# Altium project EMG_v5.PrjPcb
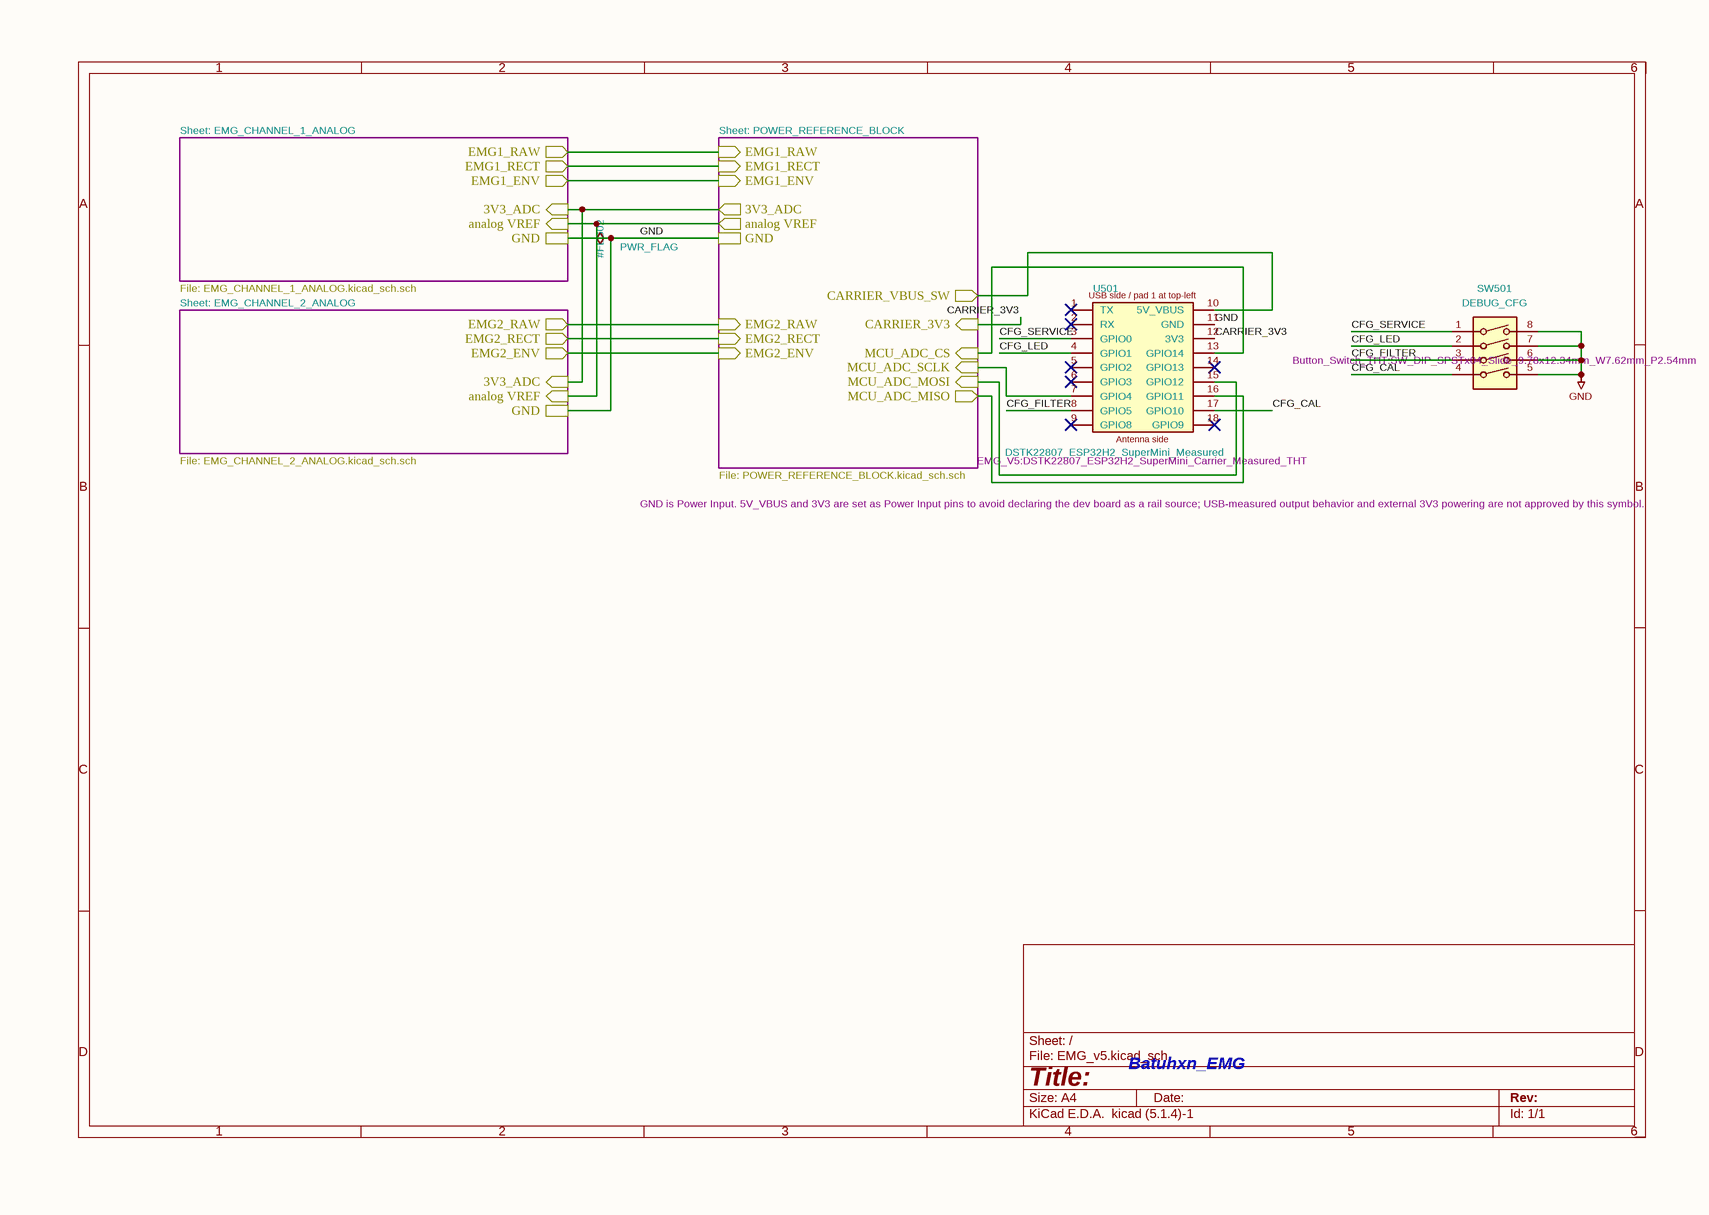
[diagram p0: EMG_v5.SchDoc]
4 sheets, 139 parts. Net scope: hierarchical (ports join the sheet entries above them; power ports are global).
Board file: EMG_v5_FAB_READY.PcbDoc
Sheets:
  EMG_v5.SchDoc
    POWER_REFERENCE_BLOCK = POWER_REFERENCE_BLOCK.SchDoc
    EMG_CHANNEL_1_ANALOG = EMG_CHANNEL_1_ANALOG.SchDoc
    EMG_CHANNEL_2_ANALOG = EMG_CHANNEL_2_ANALOG.SchDoc

## Sheet EMG_v5.SchDoc
size 297 x 209 mm

### Parts
#FLG02  PWR_FLAG  (graphical)
SW501  Footprint: Button_Switch_THT:SW_DIP_SPSTx04_Slide_9.78x12.34mm_W7.62mm_P2.54mm  [SW_DIP_SPSTx04_Slide_9.78x12.34mm_W7.62mm_P2.54mm]  (hidden comment: DEBUG_CFG)
U501  Power_Assumption: GND is Power Input. 5V_VBUS and 3V3 are set as Power Input pins to avoid declaring the dev board as a rail source; USB-measured output behavior and external 3V3 powering are not approved by this symbol.  Footprint: EMG_V5:DSTK22807_ESP32H2_SuperMini_Carrier_Measured_THT  [DSTK22807_ESP32H2_SuperMini_Carrier_Measured_THT]  (hidden comment: DSTK22807_ESP32H2_SuperMini_Measured)

### Sub-sheets
EMG_CHANNEL_1_ANALOG = EMG_CHANNEL_1_ANALOG.SchDoc: EMG1_RAW (out), EMG1_RECT (out), EMG1_ENV (out), 3V3_ADC (in), analog VREF (in), GND
EMG_CHANNEL_2_ANALOG = EMG_CHANNEL_2_ANALOG.SchDoc: EMG2_RAW (out), EMG2_RECT (out), EMG2_ENV (out), 3V3_ADC (in), analog VREF (in), GND
POWER_REFERENCE_BLOCK = POWER_REFERENCE_BLOCK.SchDoc: EMG1_RAW (in), EMG1_RECT (in), EMG1_ENV (in), EMG2_RAW (in), EMG2_RECT (in), EMG2_ENV (in), 3V3_ADC (out), analog VREF (out), GND, CARRIER_VBUS_SW (out), CARRIER_3V3 (in), MCU_ADC_MISO (out), MCU_ADC_MOSI (in), MCU_ADC_SCLK (in), MCU_ADC_CS (in)

### Nets
GND: #FLG02.1 SW501.5 SW501.6 SW501.7 SW501.8 U501.11(GND) ; sheet POWER_REFERENCE_BLOCK/GND, sheet EMG_CHANNEL_1_ANALOG/GND, sheet EMG_CHANNEL_2_ANALOG/GND
3V3_ADC: sheet POWER_REFERENCE_BLOCK/3V3_ADC, sheet EMG_CHANNEL_1_ANALOG/3V3_ADC, sheet EMG_CHANNEL_2_ANALOG/3V3_ADC
analog VREF: sheet POWER_REFERENCE_BLOCK/analog VREF, sheet EMG_CHANNEL_1_ANALOG/analog VREF, sheet EMG_CHANNEL_2_ANALOG/analog VREF
CARRIER_3V3: U501.12(3V3) ; sheet POWER_REFERENCE_BLOCK/CARRIER_3V3
CARRIER_VBUS_SW: U501.10(5V_VBUS) ; sheet POWER_REFERENCE_BLOCK/CARRIER_VBUS_SW
CFG_CAL: SW501.4 U501.17(GPIO10)
CFG_FILTER: SW501.3 U501.8(GPIO5)
CFG_LED: SW501.2 U501.4(GPIO1)
CFG_SERVICE: SW501.1 U501.3(GPIO0)
EMG1_ENV: sheet POWER_REFERENCE_BLOCK/EMG1_ENV, sheet EMG_CHANNEL_1_ANALOG/EMG1_ENV
EMG1_RAW: sheet POWER_REFERENCE_BLOCK/EMG1_RAW, sheet EMG_CHANNEL_1_ANALOG/EMG1_RAW
EMG1_RECT: sheet POWER_REFERENCE_BLOCK/EMG1_RECT, sheet EMG_CHANNEL_1_ANALOG/EMG1_RECT
EMG2_ENV: sheet POWER_REFERENCE_BLOCK/EMG2_ENV, sheet EMG_CHANNEL_2_ANALOG/EMG2_ENV
EMG2_RAW: sheet POWER_REFERENCE_BLOCK/EMG2_RAW, sheet EMG_CHANNEL_2_ANALOG/EMG2_RAW
EMG2_RECT: sheet POWER_REFERENCE_BLOCK/EMG2_RECT, sheet EMG_CHANNEL_2_ANALOG/EMG2_RECT
MCU_ADC_CS: U501.13(GPIO14) ; sheet POWER_REFERENCE_BLOCK/MCU_ADC_CS
MCU_ADC_MISO: U501.16(GPIO11) ; sheet POWER_REFERENCE_BLOCK/MCU_ADC_MISO
MCU_ADC_MOSI: U501.15(GPIO12) ; sheet POWER_REFERENCE_BLOCK/MCU_ADC_MOSI
MCU_ADC_SCLK: U501.7(GPIO4) ; sheet POWER_REFERENCE_BLOCK/MCU_ADC_SCLK

Not connected (* = marked no-connect by the designer): U501 1(TX)* 2(RX)* 5(GPIO2)* 6(GPIO3)* 9(GPIO8)* 14(GPIO13)* 18(GPIO9)*

### Notes on the sheet
- Sheet: EMG_CHANNEL_1_ANALOG
- Sheet: POWER_REFERENCE_BLOCK
- File: EMG_CHANNEL_1_ANALOG.kicad_sch.sch
- Sheet: EMG_CHANNEL_2_ANALOG
- File: EMG_CHANNEL_2_ANALOG.kicad_sch.sch
- File: POWER_REFERENCE_BLOCK.kicad_sch.sch
- Batuhxn_EMG
- 1
- 2
- 3
- 4
- 5
- 6
- A
- B
- C
- D
- Title:
- File: EMG_v5.kicad_sch
- Sheet: /
- KiCad E.D.A.  kicad (5.1.4)-1
- Size: A4
- Date:
- Rev:
- Id: 1/1
- (in symbol DSTK22807_ESP32H2_SuperMini_Measured) USB side / pad 1 at top-left; Antenna side

### Library data of the parts
SW501 = SW_DIP_x04: Value: DEBUG_CFG
#FLG02 = PWR_FLAG: Value: PWR_FLAG
U501 = DSTK22807_ESP32H2_SuperMini_Measured: Value: DSTK22807_ESP32H2_SuperMini_Measured

## Sheet POWER_REFERENCE_BLOCK.SchDoc
size 594 x 420 mm
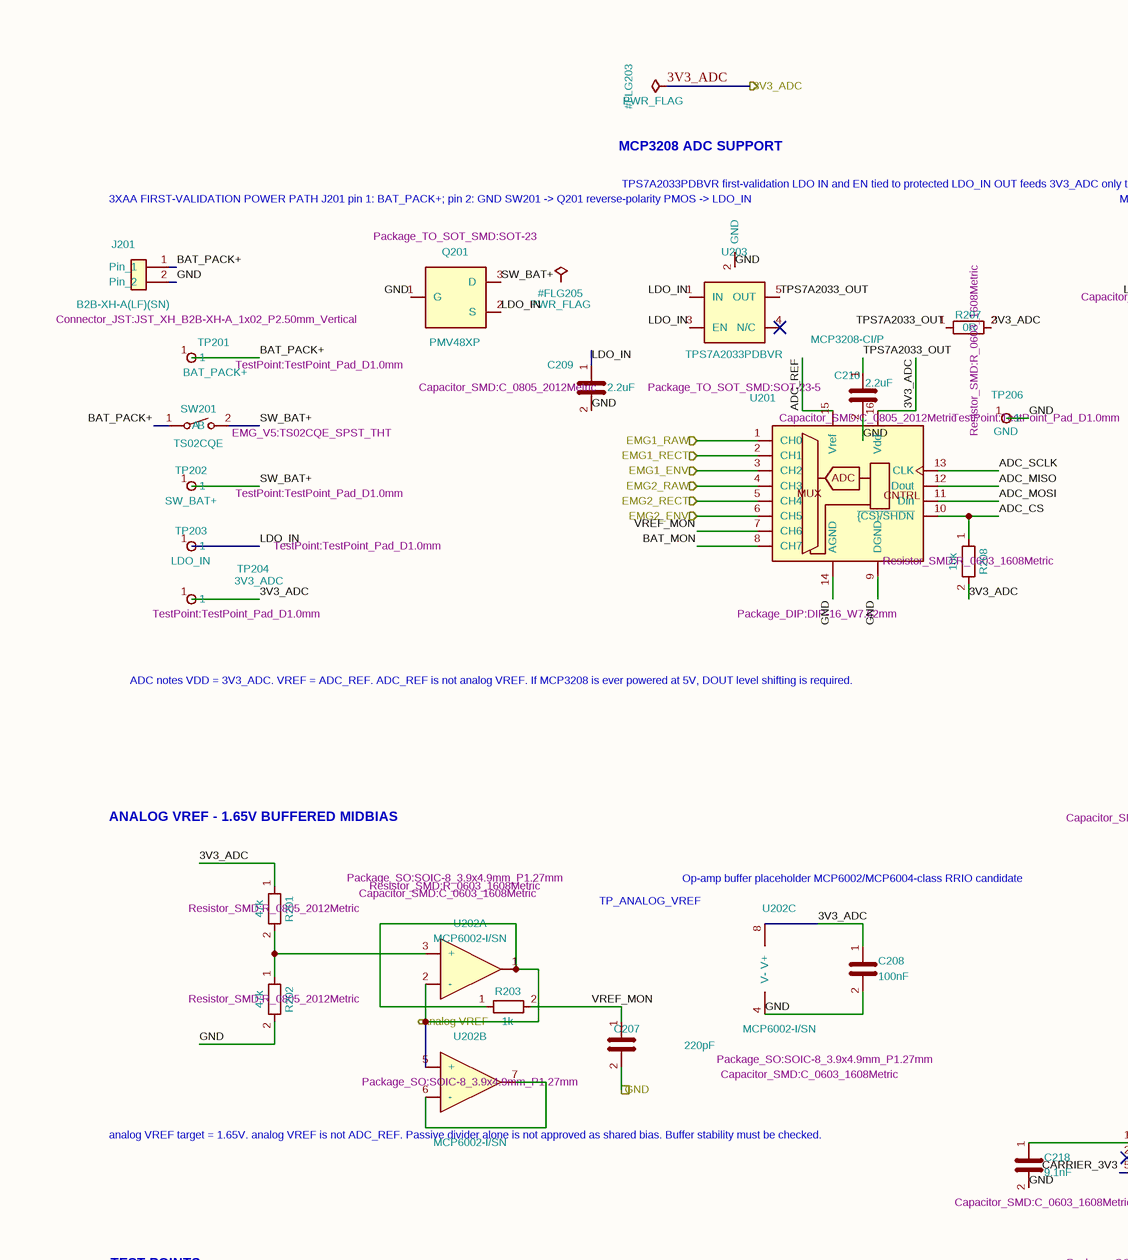
[diagram p1: POWER_REFERENCE_BLOCK.SchDoc, top left]
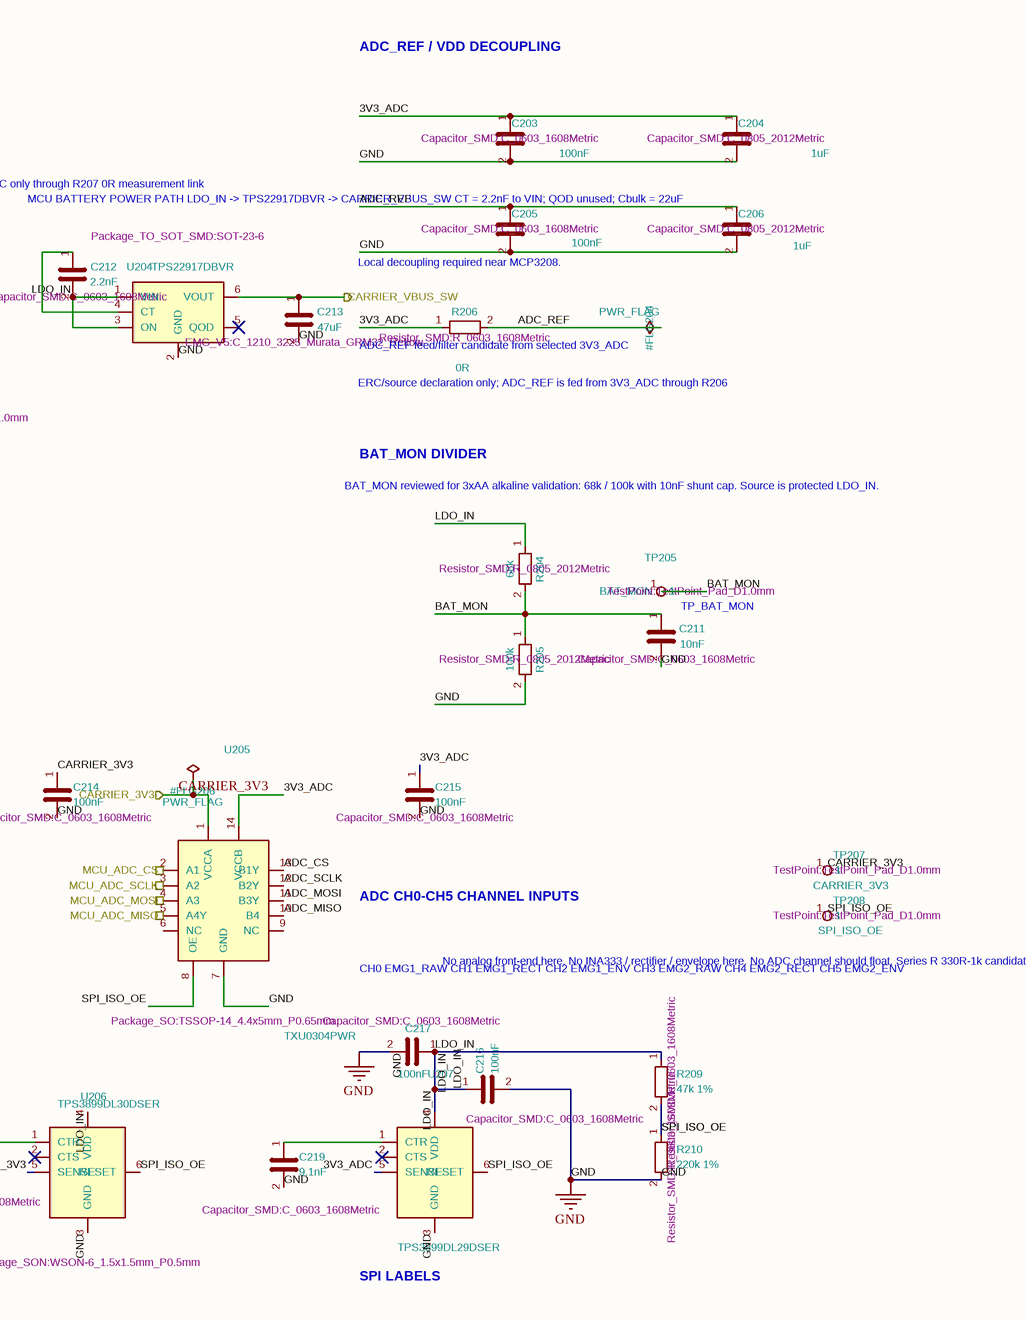
[diagram p2: POWER_REFERENCE_BLOCK.SchDoc, top right]
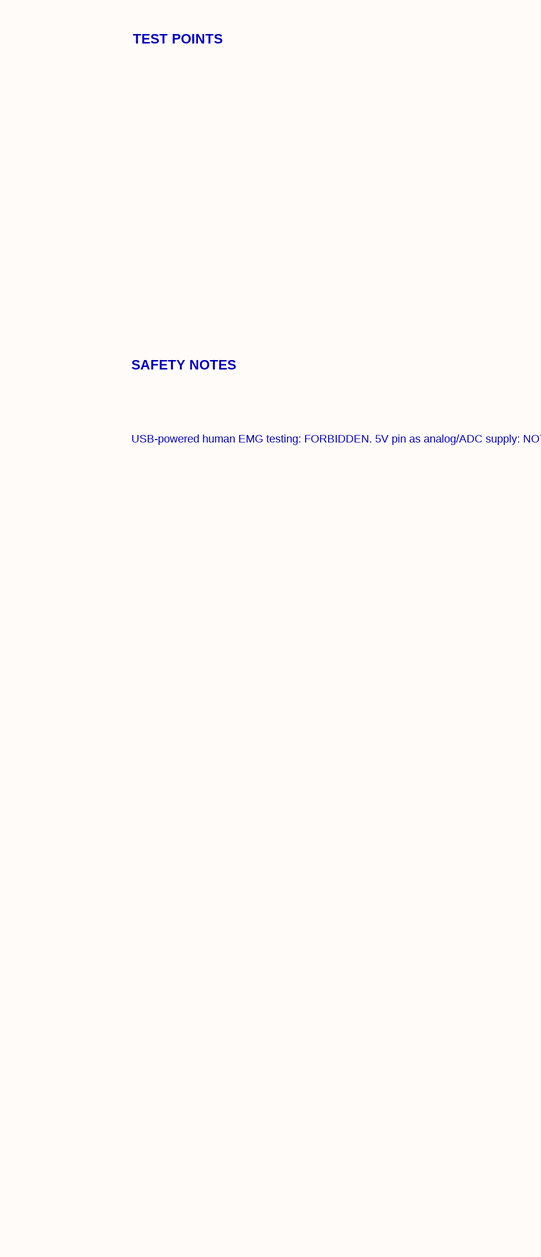
[diagram p3: POWER_REFERENCE_BLOCK.SchDoc, bottom left]
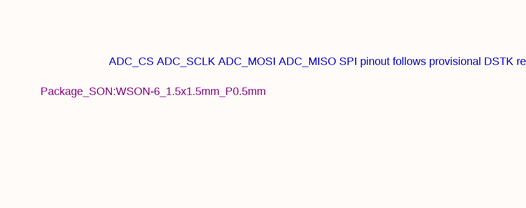
[diagram p4: POWER_REFERENCE_BLOCK.SchDoc, bottom right]

### Parts
#FLG203  PWR_FLAG  (graphical)
#FLG204  PWR_FLAG  (graphical)
#FLG205  PWR_FLAG  (graphical)
#FLG206  PWR_FLAG  (graphical)
C203  Footprint: Capacitor_SMD:C_0603_1608Metric  [C_0603_1608Metric]  (hidden comment: 100nF)
C204  Footprint: Capacitor_SMD:C_0805_2012Metric  [C_0805_2012Metric]  (hidden comment: 1uF)
C205  Footprint: Capacitor_SMD:C_0603_1608Metric  [C_0603_1608Metric]  (hidden comment: 100nF)
C206  Footprint: Capacitor_SMD:C_0805_2012Metric  [C_0805_2012Metric]  (hidden comment: 1uF)
C207  Footprint: Capacitor_SMD:C_0603_1608Metric  [C_0603_1608Metric]  (hidden comment: 220pF)
C208  Footprint: Capacitor_SMD:C_0603_1608Metric  [C_0603_1608Metric]  (hidden comment: 100nF)
C209  Footprint: Capacitor_SMD:C_0805_2012Metric  [C_0805_2012Metric]  (hidden comment: 2.2uF)
C210  Footprint: Capacitor_SMD:C_0805_2012Metric  [C_0805_2012Metric]  (hidden comment: 2.2uF)
C211  Footprint: Capacitor_SMD:C_0603_1608Metric  [C_0603_1608Metric]  (hidden comment: 10nF)
C212  Footprint: Capacitor_SMD:C_0603_1608Metric  [C_0603_1608Metric]  (hidden comment: 2.2nF)
C213  Footprint: EMG_V5:C_1210_3225_Murata_GRM32_Reflow  [C_1210_3225_Murata_GRM32_Reflow]  (hidden comment: 47uF)
C214  Footprint: Capacitor_SMD:C_0603_1608Metric  [C_0603_1608Metric]  (hidden comment: 100nF)
C215  Footprint: Capacitor_SMD:C_0603_1608Metric  [C_0603_1608Metric]  (hidden comment: 100nF)
C216  Footprint: Capacitor_SMD:C_0603_1608Metric  [C_0603_1608Metric]  (hidden comment: 100nF)
C217  Footprint: Capacitor_SMD:C_0603_1608Metric  [C_0603_1608Metric]  (hidden comment: 100nF)
C218  Footprint: Capacitor_SMD:C_0603_1608Metric  [C_0603_1608Metric]  (hidden comment: 9.1nF)
C219  Footprint: Capacitor_SMD:C_0603_1608Metric  [C_0603_1608Metric]  (hidden comment: 9.1nF)
J201  Footprint: Connector_JST:JST_XH_B2B-XH-A_1x02_P2.50mm_Vertical  [JST_XH_B2B-XH-A_1x02_P2.50mm_Vertical]  (hidden comment: B2B-XH-A(LF)(SN))
Q201  Footprint: Package_TO_SOT_SMD:SOT-23  [SOT-23]  (hidden comment: PMV48XP)
R201  Footprint: Resistor_SMD:R_0805_2012Metric  [R_0805_2012Metric]  (hidden comment: 47k)
R202  Footprint: Resistor_SMD:R_0805_2012Metric  [R_0805_2012Metric]  (hidden comment: 47k)
R203  Footprint: Resistor_SMD:R_0603_1608Metric  [R_0603_1608Metric]  (hidden comment: 1k)
R204  Footprint: Resistor_SMD:R_0805_2012Metric  [R_0805_2012Metric]  (hidden comment: 68k)
R205  Footprint: Resistor_SMD:R_0805_2012Metric  [R_0805_2012Metric]  (hidden comment: 100k)
R206  Footprint: Resistor_SMD:R_0603_1608Metric  [R_0603_1608Metric]  (hidden comment: 0R)
R207  Footprint: Resistor_SMD:R_0603_1608Metric  [R_0603_1608Metric]  (hidden comment: 0R)
R208  Footprint: Resistor_SMD:R_0603_1608Metric  [R_0603_1608Metric]  (hidden comment: 10k)
R209  Footprint: Resistor_SMD:R_0603_1608Metric  [R_0603_1608Metric]  (hidden comment: 47k 1%)
R210  Footprint: Resistor_SMD:R_0603_1608Metric  [R_0603_1608Metric]  (hidden comment: 220k 1%)
SW201  Footprint: EMG_V5:TS02CQE_SPST_THT  [TS02CQE_SPST_THT]  (hidden comment: TS02CQE)
TP201  Footprint: TestPoint:TestPoint_Pad_D1.0mm  [TestPoint_Pad_D1.0mm]  (hidden comment: BAT_PACK+)
TP202  Footprint: TestPoint:TestPoint_Pad_D1.0mm  [TestPoint_Pad_D1.0mm]  (hidden comment: SW_BAT+)
TP203  Footprint: TestPoint:TestPoint_Pad_D1.0mm  [TestPoint_Pad_D1.0mm]  (hidden comment: LDO_IN)
TP204  Footprint: TestPoint:TestPoint_Pad_D1.0mm  [TestPoint_Pad_D1.0mm]  (hidden comment: 3V3_ADC)
TP205  Footprint: TestPoint:TestPoint_Pad_D1.0mm  [TestPoint_Pad_D1.0mm]  (hidden comment: BAT_MON)
TP206  Footprint: TestPoint:TestPoint_Pad_D1.0mm  [TestPoint_Pad_D1.0mm]  (hidden comment: GND)
TP207  Footprint: TestPoint:TestPoint_Pad_D1.0mm  [TestPoint_Pad_D1.0mm]  (hidden comment: CARRIER_3V3)
TP208  Footprint: TestPoint:TestPoint_Pad_D1.0mm  [TestPoint_Pad_D1.0mm]  (hidden comment: SPI_ISO_OE)
U201  Footprint: Package_DIP:DIP-16_W7.62mm  [DIP-16_W7.62mm]  (hidden comment: MCP3208-CI/P)
U202  Footprint: Package_SO:SOIC-8_3.9x4.9mm_P1.27mm  [SOIC-8_3.9x4.9mm_P1.27mm]  (hidden comment: MCP6002-I/SN)  (parts A,B,C of 3)
U203  Footprint: Package_TO_SOT_SMD:SOT-23-5  [SOT-23-5]  (hidden comment: TPS7A2033PDBVR)
U204  Footprint: Package_TO_SOT_SMD:SOT-23-6  [SOT-23-6]  (hidden comment: TPS22917DBVR)
U205  Footprint: Package_SO:TSSOP-14_4.4x5mm_P0.65mm  [TSSOP-14_4.4x5mm_P0.65mm]  (hidden comment: TXU0304PWR)
U206  Footprint: Package_SON:WSON-6_1.5x1.5mm_P0.5mm  [WSON-6_1.5x1.5mm_P0.5mm]  (hidden comment: TPS3899DL30DSER)
U207  Footprint: Package_SON:WSON-6_1.5x1.5mm_P0.5mm  [WSON-6_1.5x1.5mm_P0.5mm]  (hidden comment: TPS3899DL29DSER)

### Ports
3V3_ADC (out), analog VREF (out), CARRIER_3V3 (in), CARRIER_VBUS_SW (out), EMG1_ENV (in), EMG1_RAW (in), EMG1_RECT (in), EMG2_ENV (in), EMG2_RAW (in), EMG2_RECT (in), GND, MCU_ADC_CS (in), MCU_ADC_MISO (out), MCU_ADC_MOSI (in), MCU_ADC_SCLK (in)

### Nets
GND: C203.2 C204.2 C205.2 C206.2 C207.2 C208.2 C209.2 C210.2 C211.2 C213.2 C214.2 C215.2 C216.2 C217.2 C218.2 C219.2 J201.2(Pin_2) Q201.1(G) R202.2 R205.2 R210.2 TP206.1 U201.9(DGND) U201.14(AGND) U202.4(V-) U203.2(GND) U204.2(GND) U205.7(GND) U206.3(GND) U207.3(GND) ; port GND
3V3_ADC: #FLG203.1 C203.1 C204.1 C208.1 C215.1 R201.1 R206.1 R207.2 R208.2 TP204.1 U201.16(Vdd) U202.8(V+) U205.14(VCCB) U207.5(SENSE) ; port 3V3_ADC
ADC_CS: R208.1 U201.10(~{{CS}/SHDN}) U205.13(B1Y)
ADC_MISO: U201.12(Dout) U205.10(B4)
ADC_MOSI: U201.11(Din) U205.11(B3Y)
ADC_REF: #FLG204.1 C205.1 C206.1 R206.2 U201.15(Vref)
ADC_SCLK: U201.13(CLK) U205.12(B2Y)
analog VREF: R203.1 U202.1 U202.2(-) U202.5(+) ; port analog VREF
BAT_MON: C211.1 R204.2 R205.1 TP205.1 U201.8(CH7)
BAT_PACK+: J201.1(Pin_1) SW201.1(A) TP201.1
CARRIER_3V3: #FLG206.1 C214.1 TP207.1 U205.1(VCCA) U206.5(SENSE) ; port CARRIER_3V3
CARRIER_VBUS_SW: C213.1 U204.6(VOUT) ; port CARRIER_VBUS_SW
EMG1_ENV: U201.3(CH2) ; port EMG1_ENV
EMG1_RAW: U201.1(CH0) ; port EMG1_RAW
EMG1_RECT: U201.2(CH1) ; port EMG1_RECT
EMG2_ENV: U201.6(CH5) ; port EMG2_ENV
EMG2_RAW: U201.4(CH3) ; port EMG2_RAW
EMG2_RECT: U201.5(CH4) ; port EMG2_RECT
LDO_IN: C209.1 C212.2 C216.1 C217.1 Q201.2(S) R204.1 R209.1 TP203.1 U203.1(IN) U203.3(EN) U204.1(VIN) U204.3(ON) U206.4(VDD) U207.4(VDD)
MCU_ADC_CS: U205.2(A1) ; port MCU_ADC_CS
MCU_ADC_MISO: U205.5(A4Y) ; port MCU_ADC_MISO
MCU_ADC_MOSI: U205.4(A3) ; port MCU_ADC_MOSI
MCU_ADC_SCLK: U205.3(A2) ; port MCU_ADC_SCLK
SPI_ISO_OE: R209.2 R210.1 TP208.1 U205.8(OE) U206.6(RESET) U207.6(RESET)
SW_BAT+: Q201.3(D) SW201.2(B) TP202.1
TPS7A2033_OUT: C210.1 R207.1 U203.5(OUT)
VREF_MON: C207.1 R203.2 U201.7(CH6)
NetC212_1: C212.1 U204.4(CT)
NetC218_1: C218.1 U206.1(CTR)
NetC219_1: C219.1 U207.1(CTR)
NetR201_2: R201.2 R202.1 U202.3(+)
NetU202_6: U202.6(-) U202.7

Not connected (* = marked no-connect by the designer): #FLG205 1; U203 4(N/C)*; U204 5(QOD)*; U205 6(NC) 9(NC); U206 2(CTS)*; U207 2(CTS)*

### Notes on the sheet
- ADC_REF / VDD DECOUPLING
- 3XAA FIRST-VALIDATION POWER PATH
  J201 pin 1: BAT_PACK+; pin 2: GND
  SW201 -> Q201 reverse-polarity PMOS -> LDO_IN
- (near #FLG203) MCP3208 ADC SUPPORT
- TPS7A2033PDBVR first-validation LDO
  IN and EN tied to protected LDO_IN
  OUT feeds 3V3_ADC only through R207 0R measurement link
- (near C205) MCU BATTERY POWER PATH
  LDO_IN -> TPS22917DBVR -> CARRIER_VBUS_SW
  CT = 2.2nF to VIN; QOD unused; Cbulk = 22uF
- (near C205) Local decoupling required near MCP3208.
- (near R206) ADC_REF feed/filter candidate from selected 3V3_ADC
- ERC/source declaration only; ADC_REF is fed from 3V3_ADC through R206
- BAT_MON reviewed for 3xAA alkaline validation: 68k / 100k with 10nF shunt cap. Source is protected LDO_IN.
- BAT_MON DIVIDER
- TP_BAT_MON
- ADC notes
  VDD = 3V3_ADC.
  VREF = ADC_REF.
  ADC_REF is not analog VREF.
  If MCP3208 is ever powered at 5V,
  DOUT level shifting is required.
- ANALOG VREF - 1.65V BUFFERED MIDBIAS
- Op-amp buffer placeholder
  MCP6002/MCP6004-class RRIO candidate
- TP_ANALOG_VREF
- ADC CH0-CH5 CHANNEL INPUTS
- (near TP208) No analog front-end here.
  No INA333 / rectifier / envelope here.
  No ADC channel should float.
  Series R 330R-1k candidate.
  C candidates: RAW/RECT 100pF-1nF, ENV 1nF-10nF.
- CH0 EMG1_RAW
  CH1 EMG1_RECT
  CH2 EMG1_ENV
  CH3 EMG2_RAW
  CH4 EMG2_RECT
  CH5 EMG2_ENV
- (near U202) analog VREF target = 1.65V.
  analog VREF is not ADC_REF.
  Passive divider alone is not approved as shared bias.
  Buffer stability must be checked.
- TEST POINTS
- (near U207) SPI LABELS
- ADC_CS
  ADC_SCLK
  ADC_MOSI
  ADC_MISO
  SPI pinout follows provisional DSTK review.
  Do not connect to DSTK in this task.
- SAFETY NOTES
- USB-powered human EMG testing: FORBIDDEN.
  5V pin as analog/ADC supply: NOT APPROVED.
  3V3 external powering of DSTK22807: NOT APPROVED YET.
  Battery-powered isolated operation required for human-contact testing.
  This is not a certified medical device.
  Do not use earth-referenced equipment while electrodes are attached to a human.
- 1
- 2
- 3
- 4
- 5
- 6
- 7
- 8
- 9
- 10
- 11
- A
- B
- C
- D
- E
- F
- G
- H
- Title:
- File: POWER_REFERENCE_BLOCK.kicad_sch
- Sheet: /
- KiCad E.D.A.  kicad (5.1.4)-1
- Size: A2
- Date:
- Rev:
- Id: 1/1
- (in symbol MCP3208) ADC; MUX; CNTRL

### Library data of the parts
C203-C219 = C
  C203 C205 C208 C214-C217: Value: 100nF
  C204 C206: Value: 1uF
  C207: Value: 220pF
  C209 C210: Value: 2.2uF
  C211: Value: 10nF
  C212: Value: 2.2nF
  C213: Value: 47uF
  C218 C219: Value: 9.1nF
J201 = EMG_Conn_01x02_Pin: Value: B2B-XH-A(LF)(SN)
R201-R210 = R
  R201 R202: Value: 47k
  R203: Value: 1k
  R204: Value: 68k
  R205: Value: 100k
  R206 R207: Value: 0R
  R208: Value: 10k
  R209: Value: 47k 1%
  R210: Value: 220k 1%
SW201 = EMG_SW_SPST: Value: TS02CQE
TP201 TP207 TP208 = EMG_TestPoint_1
  TP201: Value: BAT_PACK+
  TP207: Value: CARRIER_3V3
  TP208: Value: SPI_ISO_OE
TP202 = EMG_TestPoint_2: Value: SW_BAT+
TP203 = EMG_TestPoint_3: Value: LDO_IN
TP204 = EMG_TestPoint_4: Value: 3V3_ADC
TP205 = EMG_TestPoint_5: Value: BAT_MON
TP206 = EMG_TestPoint: Value: GND
U201 = MCP3208: Value: MCP3208-CI/P
U202 = MCP6002-xP: Value: MCP6002-I/SN
U204 = TPS22917DBV: Value: TPS22917DBVR
U205 = TXU0304PWR_1: Value: TXU0304PWR
U206 U207 = TPS3899DL_DSE_1
  U206: Value: TPS3899DL30DSER
  U207: Value: TPS3899DL29DSER
#FLG203-#FLG206 = PWR_FLAG: Value: PWR_FLAG
Q201 = PMV48XP: Value: PMV48XP
U203 = TPS7A2033PDBVR: Value: TPS7A2033PDBVR

## Sheet EMG_CHANNEL_1_ANALOG.SchDoc
size 594 x 420 mm
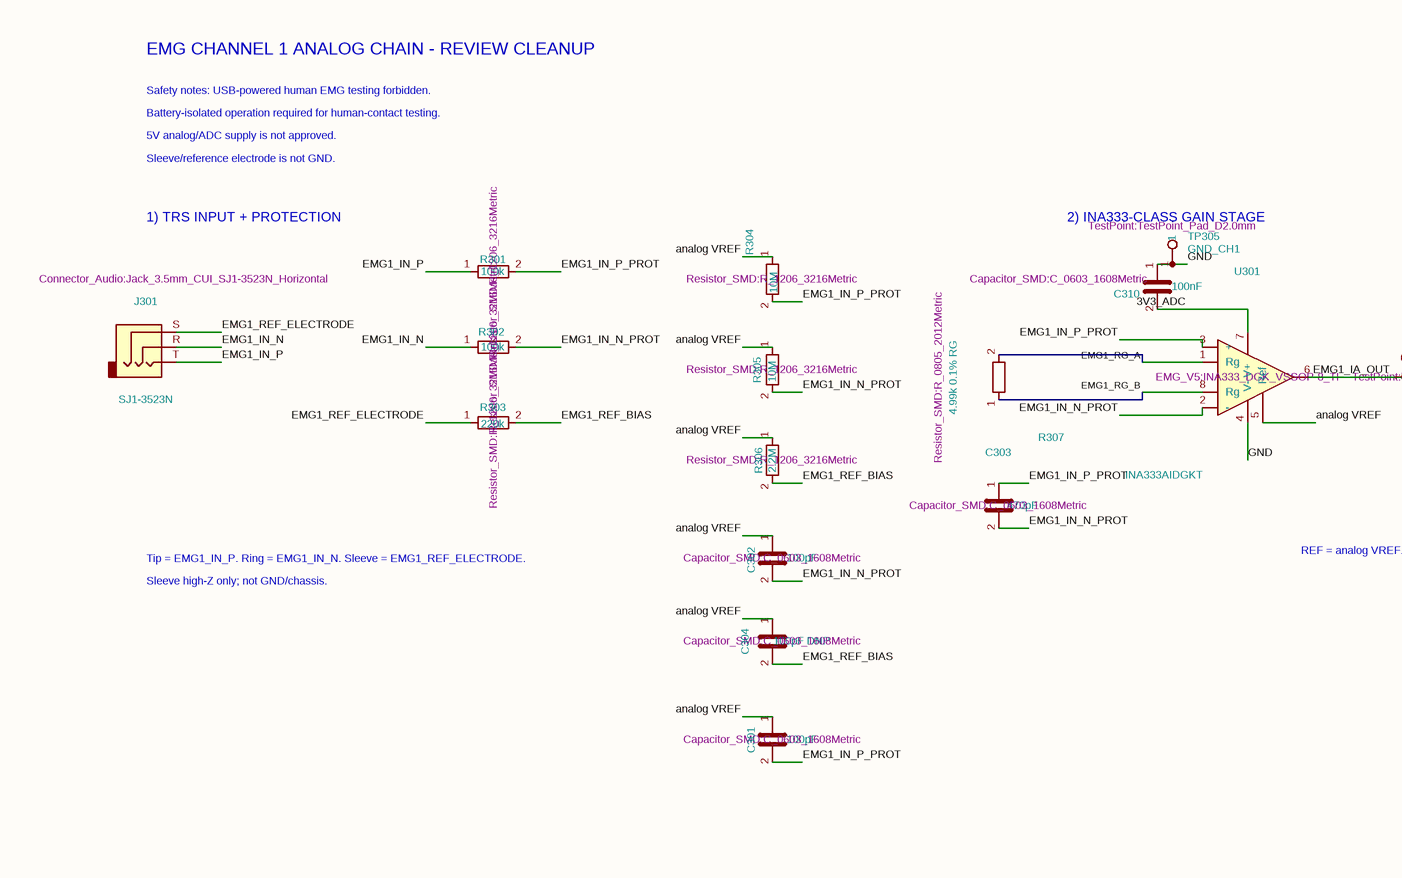
[diagram p5: EMG_CHANNEL_1_ANALOG.SchDoc, left]
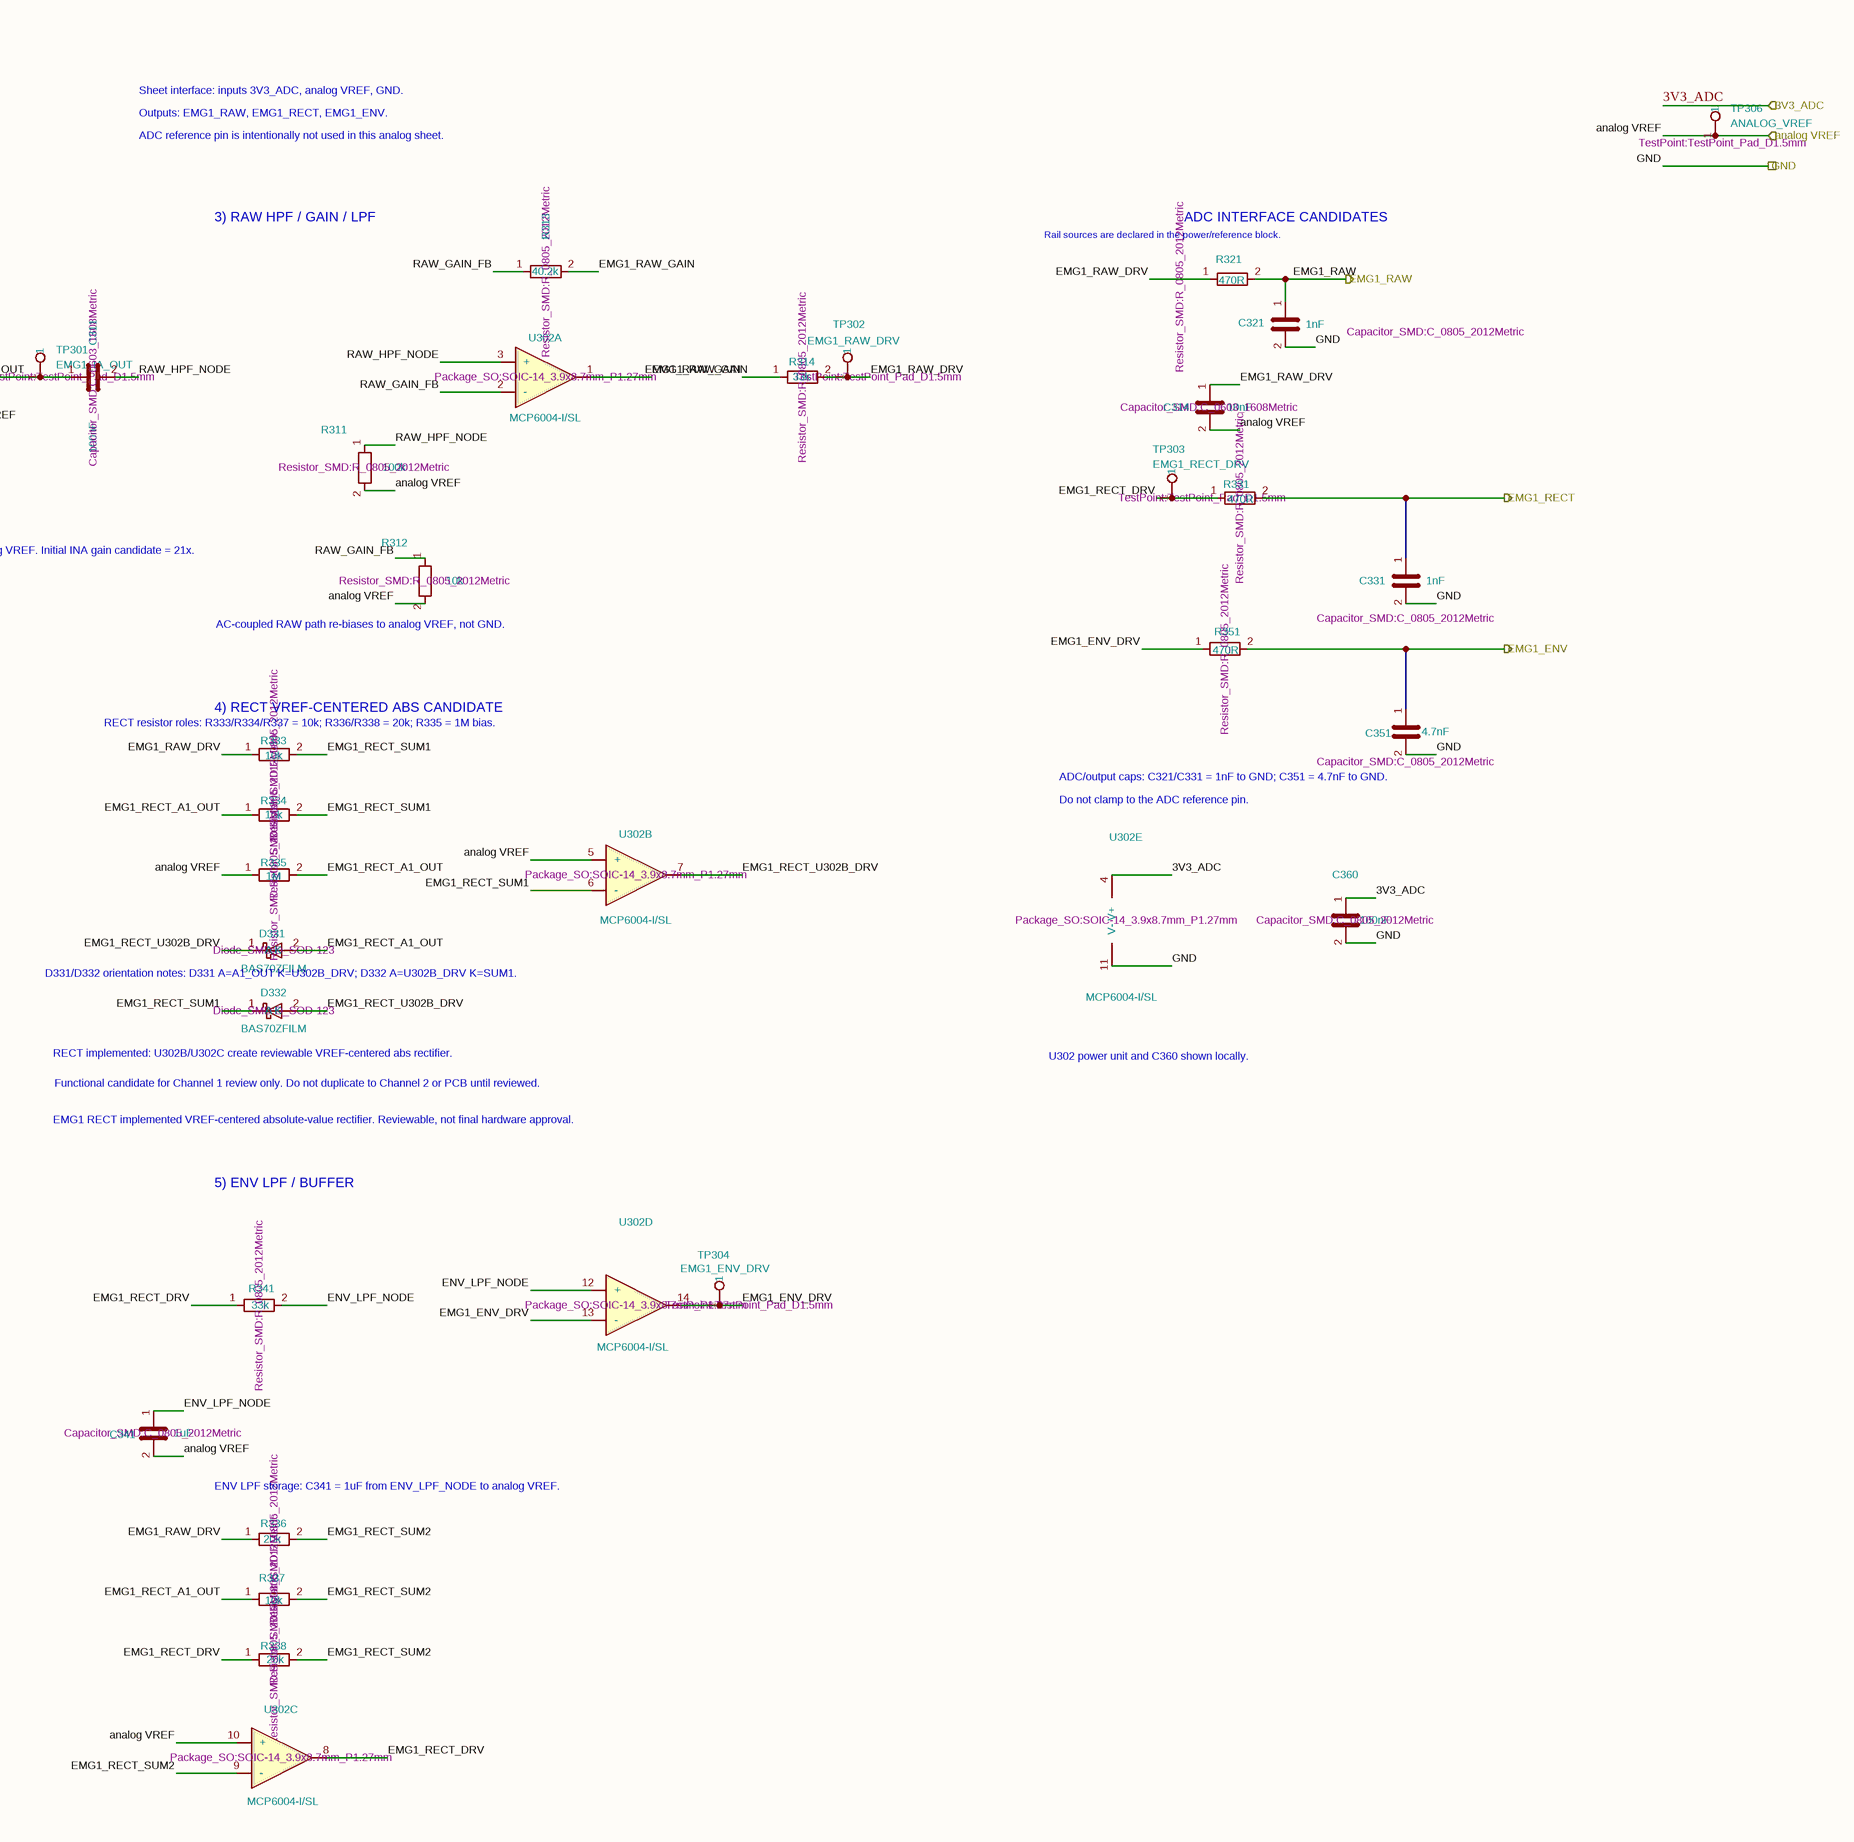
[diagram p6: EMG_CHANNEL_1_ANALOG.SchDoc, right]

### Parts
C301  Footprint: Capacitor_SMD:C_0603_1608Metric  [C_0603_1608Metric]  (hidden comment: 100pF)
C302  Footprint: Capacitor_SMD:C_0603_1608Metric  [C_0603_1608Metric]  (hidden comment: 100pF)
C303  Footprint: Capacitor_SMD:C_0603_1608Metric  [C_0603_1608Metric]  (hidden comment: 470pF)
C304  Footprint: Capacitor_SMD:C_0603_1608Metric  [C_0603_1608Metric]  (hidden comment: 100pF DNP)
C310  Footprint: Capacitor_SMD:C_0603_1608Metric  [C_0603_1608Metric]  (hidden comment: 100nF)
C311  Footprint: Capacitor_SMD:C_0603_1608Metric  [C_0603_1608Metric]  (hidden comment: 100nF)
C314  Footprint: Capacitor_SMD:C_0603_1608Metric  [C_0603_1608Metric]  (hidden comment: 10nF)
C321  Footprint: Capacitor_SMD:C_0805_2012Metric  [C_0805_2012Metric]  (hidden comment: 1nF)
C331  Footprint: Capacitor_SMD:C_0805_2012Metric  [C_0805_2012Metric]  (hidden comment: 1nF)
C341  Footprint: Capacitor_SMD:C_0805_2012Metric  [C_0805_2012Metric]  (hidden comment: 1uF)
C351  Footprint: Capacitor_SMD:C_0805_2012Metric  [C_0805_2012Metric]  (hidden comment: 4.7nF)
C360  Footprint: Capacitor_SMD:C_0805_2012Metric  [C_0805_2012Metric]  (hidden comment: 100nF)
D331  Footprint: Diode_SMD:D_SOD-123  [D_SOD-123]  (hidden comment: BAS70ZFILM)
D332  Footprint: Diode_SMD:D_SOD-123  [D_SOD-123]  (hidden comment: BAS70ZFILM)
J301  Footprint: Connector_Audio:Jack_3.5mm_CUI_SJ1-3523N_Horizontal  [Jack_3.5mm_CUI_SJ1-3523N_Horizontal]  (hidden comment: SJ1-3523N)
R301  Footprint: Resistor_SMD:R_1206_3216Metric  [R_1206_3216Metric]  (hidden comment: 100k)
R302  Footprint: Resistor_SMD:R_1206_3216Metric  [R_1206_3216Metric]  (hidden comment: 100k)
R303  Footprint: Resistor_SMD:R_1206_3216Metric  [R_1206_3216Metric]  (hidden comment: 220k)
R304  Footprint: Resistor_SMD:R_1206_3216Metric  [R_1206_3216Metric]  (hidden comment: 10M)
R305  Footprint: Resistor_SMD:R_1206_3216Metric  [R_1206_3216Metric]  (hidden comment: 10M)
R306  Footprint: Resistor_SMD:R_1206_3216Metric  [R_1206_3216Metric]  (hidden comment: 2.2M)
R307  Footprint: Resistor_SMD:R_0805_2012Metric  [R_0805_2012Metric]  (hidden comment: 4.99k 0.1% RG)
R311  Footprint: Resistor_SMD:R_0805_2012Metric  [R_0805_2012Metric]  (hidden comment: 100k)
R312  Footprint: Resistor_SMD:R_0805_2012Metric  [R_0805_2012Metric]  (hidden comment: 10k)
R313  Footprint: Resistor_SMD:R_0805_2012Metric  [R_0805_2012Metric]  (hidden comment: 40.2k)
R314  Footprint: Resistor_SMD:R_0805_2012Metric  [R_0805_2012Metric]  (hidden comment: 33k)
R321  Footprint: Resistor_SMD:R_0805_2012Metric  [R_0805_2012Metric]  (hidden comment: 470R)
R331  Footprint: Resistor_SMD:R_0805_2012Metric  [R_0805_2012Metric]  (hidden comment: 470R)
R333  Footprint: Resistor_SMD:R_0805_2012Metric  [R_0805_2012Metric]  (hidden comment: 10k)
R334  Footprint: Resistor_SMD:R_0805_2012Metric  [R_0805_2012Metric]  (hidden comment: 10k)
R335  Footprint: Resistor_SMD:R_0805_2012Metric  [R_0805_2012Metric]  (hidden comment: 1M)
R336  Footprint: Resistor_SMD:R_0805_2012Metric  [R_0805_2012Metric]  (hidden comment: 20k)
R337  Footprint: Resistor_SMD:R_0805_2012Metric  [R_0805_2012Metric]  (hidden comment: 10k)
R338  Footprint: Resistor_SMD:R_0805_2012Metric  [R_0805_2012Metric]  (hidden comment: 20k)
R341  Footprint: Resistor_SMD:R_0805_2012Metric  [R_0805_2012Metric]  (hidden comment: 33k)
R351  Footprint: Resistor_SMD:R_0805_2012Metric  [R_0805_2012Metric]  (hidden comment: 470R)
TP301  Footprint: TestPoint:TestPoint_Pad_D1.5mm  [TestPoint_Pad_D1.5mm]  (hidden comment: EMG1_IA_OUT)
TP302  Footprint: TestPoint:TestPoint_Pad_D1.5mm  [TestPoint_Pad_D1.5mm]  (hidden comment: EMG1_RAW_DRV)
TP303  Footprint: TestPoint:TestPoint_Pad_D1.5mm  [TestPoint_Pad_D1.5mm]  (hidden comment: EMG1_RECT_DRV)
TP304  Footprint: TestPoint:TestPoint_Pad_D1.5mm  [TestPoint_Pad_D1.5mm]  (hidden comment: EMG1_ENV_DRV)
TP305  Footprint: TestPoint:TestPoint_Pad_D2.0mm  [TestPoint_Pad_D2.0mm]  (hidden comment: GND_CH1)
TP306  Footprint: TestPoint:TestPoint_Pad_D1.5mm  [TestPoint_Pad_D1.5mm]  (hidden comment: ANALOG_VREF)
U301  Footprint: EMG_V5:INA333_DGK_VSSOP-8_TI  [INA333_DGK_VSSOP-8_TI]  (hidden comment: INA333AIDGKT)
U302  Footprint: Package_SO:SOIC-14_3.9x8.7mm_P1.27mm  [SOIC-14_3.9x8.7mm_P1.27mm]  (hidden comment: MCP6004-I/SL)  (parts A,B,C,D,E of 5)

### Ports
3V3_ADC (in), analog VREF (in), EMG1_ENV (out), EMG1_RAW (out), EMG1_RECT (out), GND

### Nets
GND: C310.1 C321.2 C331.2 C351.2 C360.2 TP305.1 U301.4(V-) U302.11(V-) ; port GND
3V3_ADC: C310.2 C360.1 U301.7(V+) U302.4(V+) ; port 3V3_ADC
analog VREF: C301.1 C302.1 C304.1 C314.2 C341.2 R304.1 R305.1 R306.1 R311.2 R312.2 R335.1 TP306.1 U301.5(Ref) U302.5(+) U302.10(+) ; port analog VREF
EMG1_ENV: C351.1 R351.2 ; port EMG1_ENV
EMG1_ENV_DRV: R351.1 TP304.1 U302.13(-) U302.14
EMG1_IA_OUT: C311.1 TP301.1 U301.6
EMG1_IN_N: J301.R R302.1
EMG1_IN_N_PROT: C302.2 C303.2 R302.2 R305.2 U301.2(-)
EMG1_IN_P: J301.T R301.1
EMG1_IN_P_PROT: C301.2 C303.1 R301.2 R304.2 U301.3(+)
EMG1_RAW: C321.1 R321.2 ; port EMG1_RAW
EMG1_RAW_DRV: C314.1 R314.2 R321.1 R333.1 R336.1 TP302.1
EMG1_RAW_GAIN: R313.2 R314.1 U302.1
EMG1_RECT: C331.1 R331.2 ; port EMG1_RECT
EMG1_RECT_A1_OUT: D331.2(A) R334.1 R335.2 R337.1
EMG1_RECT_DRV: R331.1 R338.1 R341.1 TP303.1 U302.8
EMG1_RECT_SUM1: D332.1(K) R333.2 R334.2 U302.6(-)
EMG1_RECT_SUM2: R336.2 R337.2 R338.2 U302.9(-)
EMG1_RECT_U302B_DRV: D331.1(K) D332.2(A) U302.7
EMG1_REF_BIAS: C304.2 R303.2 R306.2
EMG1_REF_ELECTRODE: J301.S R303.1
EMG1_RG_A: R307.2 U301.1(Rg)
EMG1_RG_B: R307.1 U301.8(Rg)
ENV_LPF_NODE: C341.1 R341.2 U302.12(+)
RAW_GAIN_FB: R312.1 R313.1 U302.2(-)
RAW_HPF_NODE: C311.2 R311.1 U302.3(+)

### Notes on the sheet
- EMG CHANNEL 1 ANALOG CHAIN - REVIEW CLEANUP
- Safety notes: USB-powered human EMG testing forbidden.
- Battery-isolated operation required for human-contact testing.
- Sheet interface: inputs 3V3_ADC, analog VREF, GND.
- Outputs: EMG1_RAW, EMG1_RECT, EMG1_ENV.
- 5V analog/ADC supply is not approved.
- Sleeve/reference electrode is not GND.
- ADC reference pin is intentionally not used in this analog sheet.
- 1) TRS INPUT + PROTECTION
- (near TP305) 2) INA333-CLASS GAIN STAGE
- 3) RAW HPF / GAIN / LPF
- (near R321) Rail sources are declared in the power/reference block.
- (near R321) ADC INTERFACE CANDIDATES
- Tip = EMG1_IN_P. Ring = EMG1_IN_N. Sleeve = EMG1_REF_ELECTRODE.
- REF = analog VREF. Initial INA gain candidate = 21x.
- Sleeve high-Z only; not GND/chassis.
- (near R312) AC-coupled RAW path re-biases to analog VREF, not GND.
- (near R333) RECT resistor roles: R333/R334/R337 = 10k; R336/R338 = 20k; R335 = 1M bias.
- (near R333) 4) RECT VREF-CENTERED ABS CANDIDATE
- (near C351) ADC/output caps: C321/C331 = 1nF to GND; C351 = 4.7nF to GND.
- Do not clamp to the ADC reference pin.
- D331/D332 orientation notes: D331 A=A1_OUT K=U302B_DRV; D332 A=U302B_DRV K=SUM1.
- (near D332) RECT implemented: U302B/U302C create reviewable VREF-centered abs rectifier.
- Functional candidate for Channel 1 review only. Do not duplicate to Channel 2 or PCB until reviewed.
- U302 power unit and C360 shown locally.
- EMG1 RECT implemented VREF-centered absolute-value rectifier. Reviewable, not final hardware approval.
- 5) ENV LPF / BUFFER
- (near R336) ENV LPF storage: C341 = 1uF from ENV_LPF_NODE to analog VREF.
- 1
- 2
- 3
- 4
- 5
- 6
- 7
- 8
- 9
- 10
- 11
- A
- B
- C
- D
- E
- F
- G
- H
- Title:
- File: EMG_CHANNEL_1_ANALOG.kicad_sch
- Sheet: /
- KiCad E.D.A.  kicad (5.1.4)-1
- Size: A2
- Date:
- Rev:
- Id: 1/1

### Library data of the parts
C301-C304 C310 C311 C314 C321 C331 C341 C351 C360 = C
  C301 C302: Value: 100pF
  C303: Value: 470pF
  C304: Value: 100pF DNP
  C310 C311 C360: Value: 100nF
  C314: Value: 10nF
  C321 C331: Value: 1nF
  C341: Value: 1uF
  C351: Value: 4.7nF
D331 D332 = D_Schottky: Value: BAS70ZFILM
J301 = AudioJack3: Value: SJ1-3523N
R301-R307 R311-R314 R321 R331 R333-R338 R341 R351 = R
  R301 R302 R311: Value: 100k
  R303: Value: 220k
  R304 R305: Value: 10M
  R306: Value: 2.2M
  R307: Value: 4.99k 0.1% RG
  R312 R333 R334 R337: Value: 10k
  R313: Value: 40.2k
  R314 R341: Value: 33k
  R321 R331 R351: Value: 470R
  R335: Value: 1M
  R336 R338: Value: 20k
TP301-TP306 = TestPoint
  TP301: Value: EMG1_IA_OUT
  TP302: Value: EMG1_RAW_DRV
  TP303: Value: EMG1_RECT_DRV
  TP304: Value: EMG1_ENV_DRV
  TP305: Value: GND_CH1
  TP306: Value: ANALOG_VREF
U301 = INA333xxDGK: Value: INA333AIDGKT
U302 = MCP6004: Value: MCP6004-I/SL

## Sheet EMG_CHANNEL_2_ANALOG.SchDoc
size 594 x 420 mm
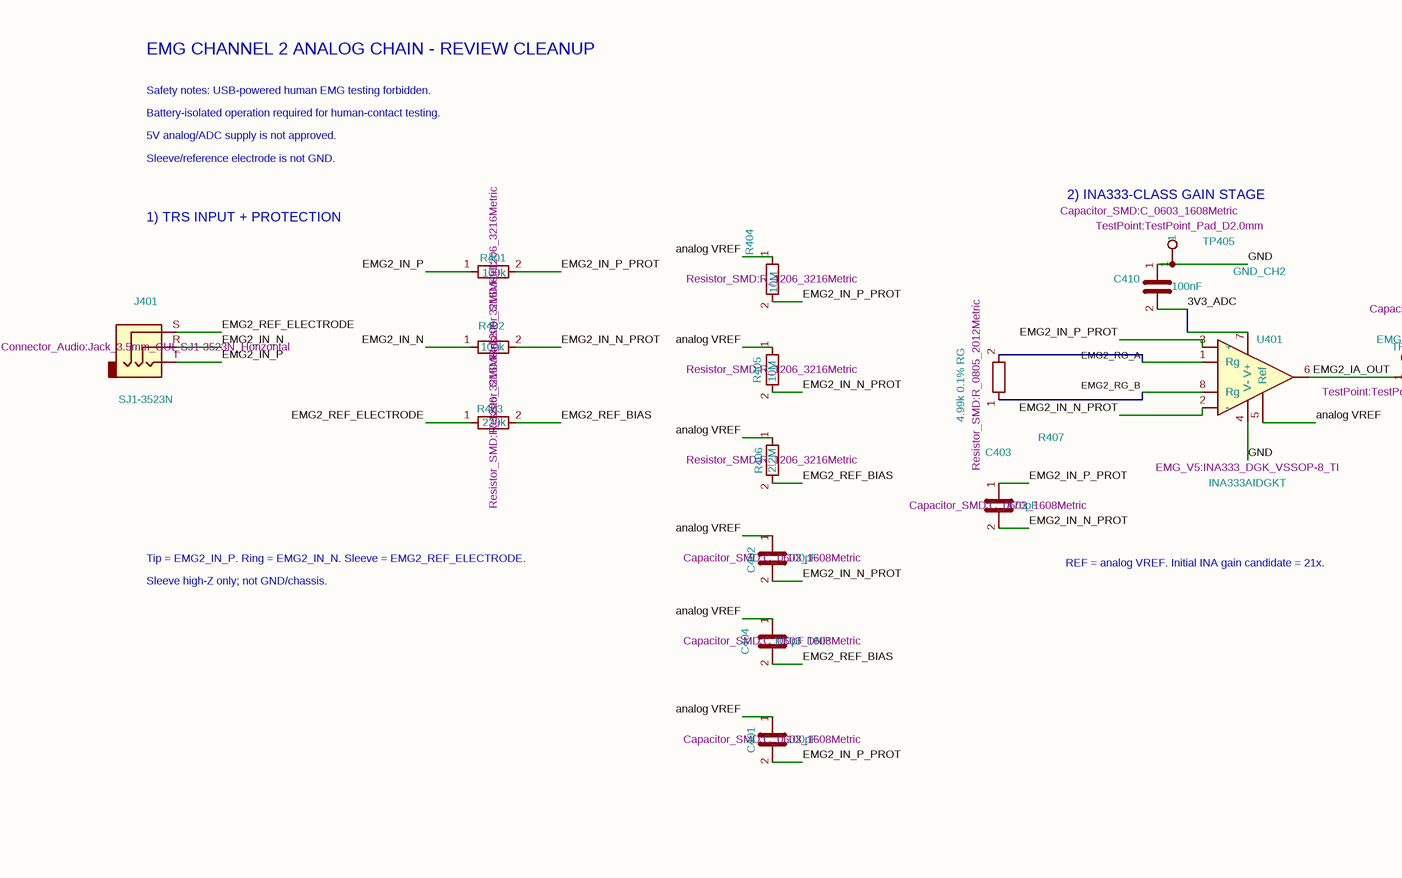
[diagram p7: EMG_CHANNEL_2_ANALOG.SchDoc, left]
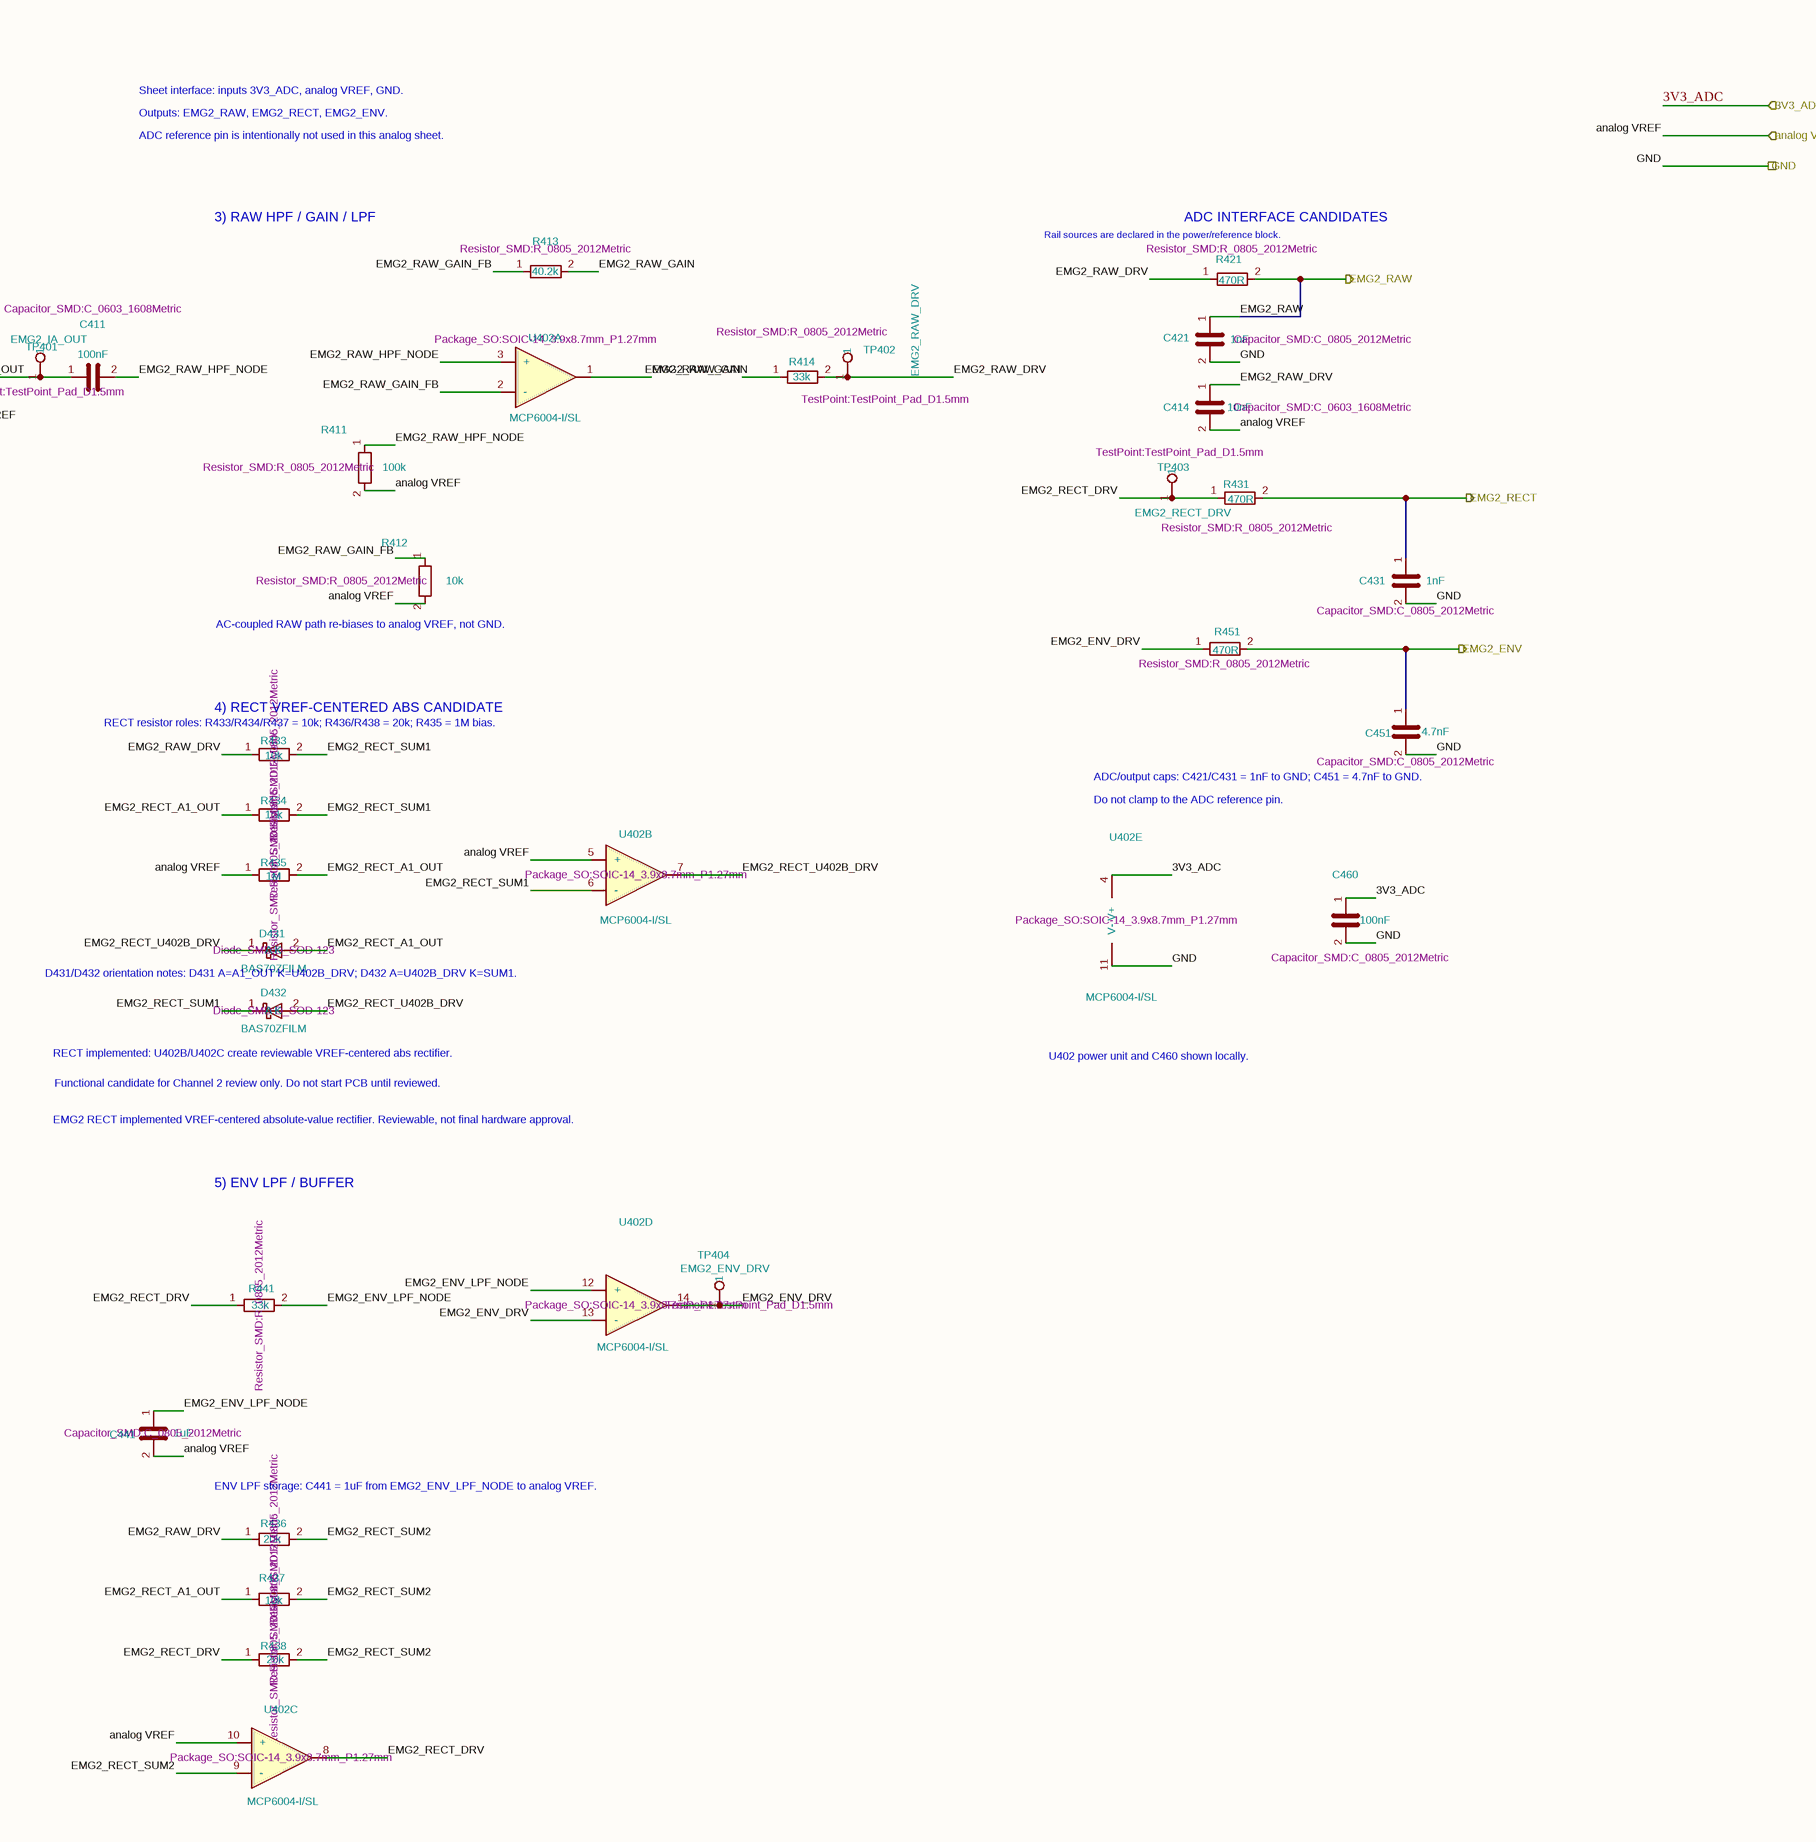
[diagram p8: EMG_CHANNEL_2_ANALOG.SchDoc, right]

### Parts
C401  Footprint: Capacitor_SMD:C_0603_1608Metric  [C_0603_1608Metric]  (hidden comment: 100pF)
C402  Footprint: Capacitor_SMD:C_0603_1608Metric  [C_0603_1608Metric]  (hidden comment: 100pF)
C403  Footprint: Capacitor_SMD:C_0603_1608Metric  [C_0603_1608Metric]  (hidden comment: 470pF)
C404  Footprint: Capacitor_SMD:C_0603_1608Metric  [C_0603_1608Metric]  (hidden comment: 100pF DNP)
C410  Footprint: Capacitor_SMD:C_0603_1608Metric  [C_0603_1608Metric]  (hidden comment: 100nF)
C411  Footprint: Capacitor_SMD:C_0603_1608Metric  [C_0603_1608Metric]  (hidden comment: 100nF)
C414  Footprint: Capacitor_SMD:C_0603_1608Metric  [C_0603_1608Metric]  (hidden comment: 10nF)
C421  Footprint: Capacitor_SMD:C_0805_2012Metric  [C_0805_2012Metric]  (hidden comment: 1nF)
C431  Footprint: Capacitor_SMD:C_0805_2012Metric  [C_0805_2012Metric]  (hidden comment: 1nF)
C441  Footprint: Capacitor_SMD:C_0805_2012Metric  [C_0805_2012Metric]  (hidden comment: 1uF)
C451  Footprint: Capacitor_SMD:C_0805_2012Metric  [C_0805_2012Metric]  (hidden comment: 4.7nF)
C460  Footprint: Capacitor_SMD:C_0805_2012Metric  [C_0805_2012Metric]  (hidden comment: 100nF)
D431  Footprint: Diode_SMD:D_SOD-123  [D_SOD-123]  (hidden comment: BAS70ZFILM)
D432  Footprint: Diode_SMD:D_SOD-123  [D_SOD-123]  (hidden comment: BAS70ZFILM)
J401  Footprint: Connector_Audio:Jack_3.5mm_CUI_SJ1-3523N_Horizontal  [Jack_3.5mm_CUI_SJ1-3523N_Horizontal]  (hidden comment: SJ1-3523N)
R401  Footprint: Resistor_SMD:R_1206_3216Metric  [R_1206_3216Metric]  (hidden comment: 100k)
R402  Footprint: Resistor_SMD:R_1206_3216Metric  [R_1206_3216Metric]  (hidden comment: 100k)
R403  Footprint: Resistor_SMD:R_1206_3216Metric  [R_1206_3216Metric]  (hidden comment: 220k)
R404  Footprint: Resistor_SMD:R_1206_3216Metric  [R_1206_3216Metric]  (hidden comment: 10M)
R405  Footprint: Resistor_SMD:R_1206_3216Metric  [R_1206_3216Metric]  (hidden comment: 10M)
R406  Footprint: Resistor_SMD:R_1206_3216Metric  [R_1206_3216Metric]  (hidden comment: 2.2M)
R407  Footprint: Resistor_SMD:R_0805_2012Metric  [R_0805_2012Metric]  (hidden comment: 4.99k 0.1% RG)
R411  Footprint: Resistor_SMD:R_0805_2012Metric  [R_0805_2012Metric]  (hidden comment: 100k)
R412  Footprint: Resistor_SMD:R_0805_2012Metric  [R_0805_2012Metric]  (hidden comment: 10k)
R413  Footprint: Resistor_SMD:R_0805_2012Metric  [R_0805_2012Metric]  (hidden comment: 40.2k)
R414  Footprint: Resistor_SMD:R_0805_2012Metric  [R_0805_2012Metric]  (hidden comment: 33k)
R421  Footprint: Resistor_SMD:R_0805_2012Metric  [R_0805_2012Metric]  (hidden comment: 470R)
R431  Footprint: Resistor_SMD:R_0805_2012Metric  [R_0805_2012Metric]  (hidden comment: 470R)
R433  Footprint: Resistor_SMD:R_0805_2012Metric  [R_0805_2012Metric]  (hidden comment: 10k)
R434  Footprint: Resistor_SMD:R_0805_2012Metric  [R_0805_2012Metric]  (hidden comment: 10k)
R435  Footprint: Resistor_SMD:R_0805_2012Metric  [R_0805_2012Metric]  (hidden comment: 1M)
R436  Footprint: Resistor_SMD:R_0805_2012Metric  [R_0805_2012Metric]  (hidden comment: 20k)
R437  Footprint: Resistor_SMD:R_0805_2012Metric  [R_0805_2012Metric]  (hidden comment: 10k)
R438  Footprint: Resistor_SMD:R_0805_2012Metric  [R_0805_2012Metric]  (hidden comment: 20k)
R441  Footprint: Resistor_SMD:R_0805_2012Metric  [R_0805_2012Metric]  (hidden comment: 33k)
R451  Footprint: Resistor_SMD:R_0805_2012Metric  [R_0805_2012Metric]  (hidden comment: 470R)
TP401  Footprint: TestPoint:TestPoint_Pad_D1.5mm  [TestPoint_Pad_D1.5mm]  (hidden comment: EMG2_IA_OUT)
TP402  Footprint: TestPoint:TestPoint_Pad_D1.5mm  [TestPoint_Pad_D1.5mm]  (hidden comment: EMG2_RAW_DRV)
TP403  Footprint: TestPoint:TestPoint_Pad_D1.5mm  [TestPoint_Pad_D1.5mm]  (hidden comment: EMG2_RECT_DRV)
TP404  Footprint: TestPoint:TestPoint_Pad_D1.5mm  [TestPoint_Pad_D1.5mm]  (hidden comment: EMG2_ENV_DRV)
TP405  Footprint: TestPoint:TestPoint_Pad_D2.0mm  [TestPoint_Pad_D2.0mm]  (hidden comment: GND_CH2)
U401  Footprint: EMG_V5:INA333_DGK_VSSOP-8_TI  [INA333_DGK_VSSOP-8_TI]  (hidden comment: INA333AIDGKT)
U402  Footprint: Package_SO:SOIC-14_3.9x8.7mm_P1.27mm  [SOIC-14_3.9x8.7mm_P1.27mm]  (hidden comment: MCP6004-I/SL)  (parts A,B,C,D,E of 5)

### Ports
3V3_ADC (in), analog VREF (in), EMG2_ENV (out), EMG2_RAW (out), EMG2_RECT (out), GND

### Nets
GND: C410.1 C421.2 C431.2 C451.2 C460.2 TP405.1 U401.4(V-) U402.11(V-) ; port GND
3V3_ADC: C410.2 C460.1 U401.7(V+) U402.4(V+) ; port 3V3_ADC
analog VREF: C401.1 C402.1 C404.1 C414.2 C441.2 R404.1 R405.1 R406.1 R411.2 R412.2 R435.1 U401.5(Ref) U402.5(+) U402.10(+) ; port analog VREF
EMG2_ENV: C451.1 R451.2 ; port EMG2_ENV
EMG2_ENV_DRV: R451.1 TP404.1 U402.13(-) U402.14
EMG2_ENV_LPF_NODE: C441.1 R441.2 U402.12(+)
EMG2_IA_OUT: C411.1 TP401.1 U401.6
EMG2_IN_N: J401.R R402.1
EMG2_IN_N_PROT: C402.2 C403.2 R402.2 R405.2 U401.2(-)
EMG2_IN_P: J401.T R401.1
EMG2_IN_P_PROT: C401.2 C403.1 R401.2 R404.2 U401.3(+)
EMG2_RAW: C421.1 R421.2 ; port EMG2_RAW
EMG2_RAW_DRV: C414.1 R414.2 R421.1 R433.1 R436.1 TP402.1
EMG2_RAW_GAIN: R413.2 R414.1 U402.1
EMG2_RAW_GAIN_FB: R412.1 R413.1 U402.2(-)
EMG2_RAW_HPF_NODE: C411.2 R411.1 U402.3(+)
EMG2_RECT: C431.1 R431.2 ; port EMG2_RECT
EMG2_RECT_A1_OUT: D431.2(A) R434.1 R435.2 R437.1
EMG2_RECT_DRV: R431.1 R438.1 R441.1 TP403.1 U402.8
EMG2_RECT_SUM1: D432.1(K) R433.2 R434.2 U402.6(-)
EMG2_RECT_SUM2: R436.2 R437.2 R438.2 U402.9(-)
EMG2_RECT_U402B_DRV: D431.1(K) D432.2(A) U402.7
EMG2_REF_BIAS: C404.2 R403.2 R406.2
EMG2_REF_ELECTRODE: J401.S R403.1
EMG2_RG_A: R407.2 U401.1(Rg)
EMG2_RG_B: R407.1 U401.8(Rg)

### Notes on the sheet
- EMG CHANNEL 2 ANALOG CHAIN - REVIEW CLEANUP
- Safety notes: USB-powered human EMG testing forbidden.
- Battery-isolated operation required for human-contact testing.
- Sheet interface: inputs 3V3_ADC, analog VREF, GND.
- Outputs: EMG2_RAW, EMG2_RECT, EMG2_ENV.
- 5V analog/ADC supply is not approved.
- Sleeve/reference electrode is not GND.
- (near TP405) 2) INA333-CLASS GAIN STAGE
- ADC reference pin is intentionally not used in this analog sheet.
- 1) TRS INPUT + PROTECTION
- 3) RAW HPF / GAIN / LPF
- (near R421) Rail sources are declared in the power/reference block.
- (near R421) ADC INTERFACE CANDIDATES
- Tip = EMG2_IN_P. Ring = EMG2_IN_N. Sleeve = EMG2_REF_ELECTRODE.
- REF = analog VREF. Initial INA gain candidate = 21x.
- Sleeve high-Z only; not GND/chassis.
- (near R412) AC-coupled RAW path re-biases to analog VREF, not GND.
- (near R433) RECT resistor roles: R433/R434/R437 = 10k; R436/R438 = 20k; R435 = 1M bias.
- (near R433) 4) RECT VREF-CENTERED ABS CANDIDATE
- (near C451) ADC/output caps: C421/C431 = 1nF to GND; C451 = 4.7nF to GND.
- Do not clamp to the ADC reference pin.
- D431/D432 orientation notes: D431 A=A1_OUT K=U402B_DRV; D432 A=U402B_DRV K=SUM1.
- (near D432) RECT implemented: U402B/U402C create reviewable VREF-centered abs rectifier.
- Functional candidate for Channel 2 review only. Do not start PCB until reviewed.
- U402 power unit and C460 shown locally.
- EMG2 RECT implemented VREF-centered absolute-value rectifier. Reviewable, not final hardware approval.
- 5) ENV LPF / BUFFER
- (near R436) ENV LPF storage: C441 = 1uF from EMG2_ENV_LPF_NODE to analog VREF.
- 1
- 2
- 3
- 4
- 5
- 6
- 7
- 8
- 9
- 10
- 11
- A
- B
- C
- D
- E
- F
- G
- H
- Title:
- File: EMG_CHANNEL_2_ANALOG.kicad_sch
- Sheet: /
- KiCad E.D.A.  kicad (5.1.4)-1
- Size: A2
- Date:
- Rev:
- Id: 1/1

### Library data of the parts
C401-C404 C410 C411 C414 C421 C431 C441 C451 C460 = C
  C401 C402: Value: 100pF
  C403: Value: 470pF
  C404: Value: 100pF DNP
  C410 C411 C460: Value: 100nF
  C414: Value: 10nF
  C421 C431: Value: 1nF
  C441: Value: 1uF
  C451: Value: 4.7nF
D431 D432 = D_Schottky: Value: BAS70ZFILM
J401 = AudioJack3: Value: SJ1-3523N
R401-R407 R411-R414 R421 R431 R433-R438 R441 R451 = R
  R401 R402 R411: Value: 100k
  R403: Value: 220k
  R404 R405: Value: 10M
  R406: Value: 2.2M
  R407: Value: 4.99k 0.1% RG
  R412 R433 R434 R437: Value: 10k
  R413: Value: 40.2k
  R414 R441: Value: 33k
  R421 R431 R451: Value: 470R
  R435: Value: 1M
  R436 R438: Value: 20k
TP401-TP405 = TestPoint
  TP401: Value: EMG2_IA_OUT
  TP402: Value: EMG2_RAW_DRV
  TP403: Value: EMG2_RECT_DRV
  TP404: Value: EMG2_ENV_DRV
  TP405: Value: GND_CH2
U401 = INA333xxDGK: Value: INA333AIDGKT
U402 = MCP6004: Value: MCP6004-I/SL

## Nets that join several sheets
GND: EMG_v5 (6 pins), POWER_REFERENCE_BLOCK (30 pins), EMG_CHANNEL_1_ANALOG (8 pins), EMG_CHANNEL_2_ANALOG (8 pins)
3V3_ADC: POWER_REFERENCE_BLOCK (14 pins), EMG_CHANNEL_1_ANALOG (C310.2 C360.1 U301.7 U302.4), EMG_CHANNEL_2_ANALOG (C410.2 C460.1 U401.7 U402.4)
analog VREF: POWER_REFERENCE_BLOCK (R203.1 U202.1 U202.2 U202.5), EMG_CHANNEL_1_ANALOG (15 pins), EMG_CHANNEL_2_ANALOG (14 pins)
CARRIER_3V3: EMG_v5 (U501.12), POWER_REFERENCE_BLOCK (5 pins)
CARRIER_VBUS_SW: EMG_v5 (U501.10), POWER_REFERENCE_BLOCK (C213.1 U204.6)
EMG1_ENV: POWER_REFERENCE_BLOCK (U201.3), EMG_CHANNEL_1_ANALOG (C351.1 R351.2)
EMG1_RAW: POWER_REFERENCE_BLOCK (U201.1), EMG_CHANNEL_1_ANALOG (C321.1 R321.2)
EMG1_RECT: POWER_REFERENCE_BLOCK (U201.2), EMG_CHANNEL_1_ANALOG (C331.1 R331.2)
EMG2_ENV: POWER_REFERENCE_BLOCK (U201.6), EMG_CHANNEL_2_ANALOG (C451.1 R451.2)
EMG2_RAW: POWER_REFERENCE_BLOCK (U201.4), EMG_CHANNEL_2_ANALOG (C421.1 R421.2)
EMG2_RECT: POWER_REFERENCE_BLOCK (U201.5), EMG_CHANNEL_2_ANALOG (C431.1 R431.2)
MCU_ADC_CS: EMG_v5 (U501.13), POWER_REFERENCE_BLOCK (U205.2)
MCU_ADC_MISO: EMG_v5 (U501.16), POWER_REFERENCE_BLOCK (U205.5)
MCU_ADC_MOSI: EMG_v5 (U501.15), POWER_REFERENCE_BLOCK (U205.4)
MCU_ADC_SCLK: EMG_v5 (U501.7), POWER_REFERENCE_BLOCK (U205.3)